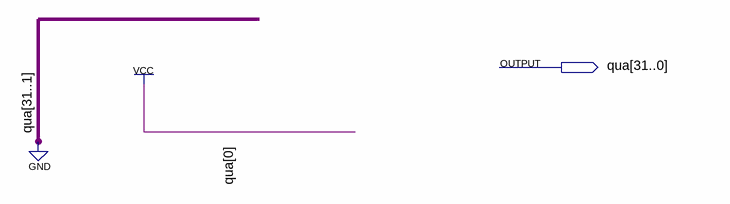
[diagram p0: schematic sheet]
// Quartus schematic maisUm.bdf as structural Verilog: 0 symbols, 1 pins
module maisUm (
  output [31:0] qua
);


  assign qua = 32'b00000000000000000000000000000001;
endmodule
